# EAGLE design led_demo (EAGLE 7.1.0)
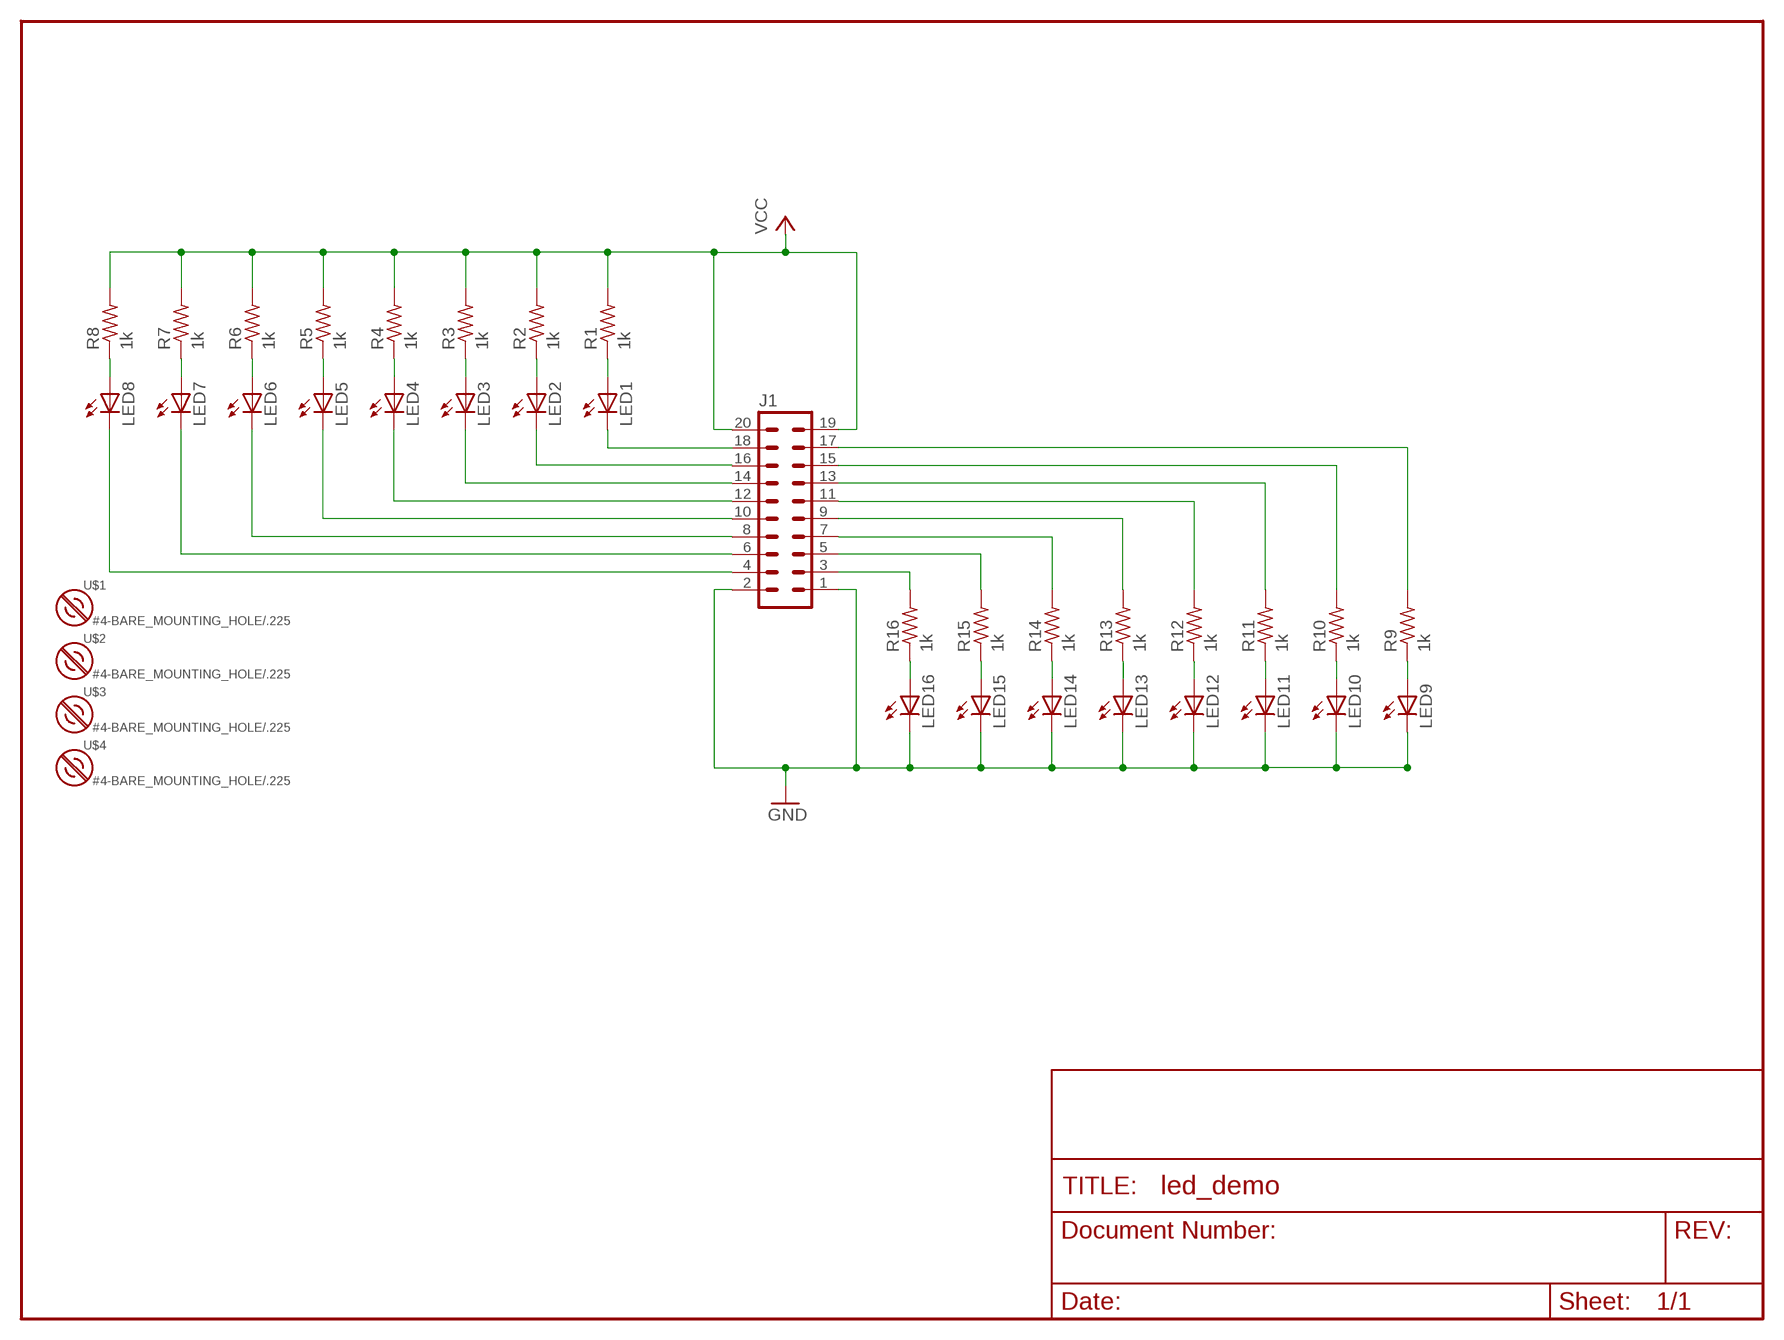
[diagram p0: schematic, sheet 1]

## Parts
J1  MA10-2  [MA10-2]
LED1  LED3MM  [LED3MM]
LED2  LED3MM  [LED3MM]
LED3  LED3MM  [LED3MM]
LED4  LED3MM  [LED3MM]
LED5  LED3MM  [LED3MM]
LED6  LED3MM  [LED3MM]
LED7  LED3MM  [LED3MM]
LED8  LED3MM  [LED3MM]
LED9  LED3MM  [LED3MM]
LED10  LED3MM  [LED3MM]
LED11  LED3MM  [LED3MM]
LED12  LED3MM  [LED3MM]
LED13  LED3MM  [LED3MM]
LED14  LED3MM  [LED3MM]
LED15  LED3MM  [LED3MM]
LED16  LED3MM  [LED3MM]
R1  1k  R-US_0204/2V  [0204V]
R2  1k  R-US_0204/2V  [0204V]
R3  1k  R-US_0204/2V  [0204V]
R4  1k  R-US_0204/2V  [0204V]
R5  1k  R-US_0204/2V  [0204V]
R6  1k  R-US_0204/2V  [0204V]
R7  1k  R-US_0204/2V  [0204V]
R8  1k  R-US_0204/2V  [0204V]
R9  1k  R-US_0204/2V  [0204V]
R10  1k  R-US_0204/2V  [0204V]
R11  1k  R-US_0204/2V  [0204V]
R12  1k  R-US_0204/2V  [0204V]
R13  1k  R-US_0204/2V  [0204V]
R14  1k  R-US_0204/2V  [0204V]
R15  1k  R-US_0204/2V  [0204V]
R16  1k  R-US_0204/2V  [0204V]
U$1  #4-BARE_MOUNTING_HOLE/.225  [#4/.225-BARE+HEAD_OR_SMALL_NUT]
U$2  #4-BARE_MOUNTING_HOLE/.225  [#4/.225-BARE+HEAD_OR_SMALL_NUT]
U$3  #4-BARE_MOUNTING_HOLE/.225  [#4/.225-BARE+HEAD_OR_SMALL_NUT]
U$4  #4-BARE_MOUNTING_HOLE/.225  [#4/.225-BARE+HEAD_OR_SMALL_NUT]

## Nets
GND: J1.1 J1.2 LED9.K(C) LED10.K(C) LED11.K(C) LED12.K(C) LED13.K(C) LED14.K(C) LED15.K(C) LED16.K(C)
N3: J1.3 R16.2
N4: J1.4 LED8.K(C)
N5: J1.5 R15.2
N6: J1.6 LED7.K(C)
N7: J1.7 R14.2
N8: J1.8 LED6.K(C)
N9: J1.9 R13.2
N10: J1.10 LED5.K(C)
N11: J1.11 R12.2
N12: J1.12 LED4.K(C)
N13: J1.13 R11.2
N14: J1.14 LED3.K(C)
N15: J1.15 R10.2
N16: J1.16 LED2.K(C)
N17: J1.17 R9.2
N18: J1.18 LED1.K(C)
N$1: LED1.A R1.1
N$2: LED2.A R2.1
N$3: LED3.A R3.1
N$4: LED4.A R4.1
N$5: LED5.A R5.1
N$6: LED6.A R6.1
N$7: LED7.A R7.1
N$8: LED8.A R8.1
N$17: LED9.A R9.1
N$18: LED10.A R10.1
N$19: LED11.A R11.1
N$20: LED12.A R12.1
N$21: LED13.A R13.1
N$22: LED14.A R14.1
N$23: LED15.A R15.1
N$24: LED16.A R16.1
VCC: J1.19 J1.20 R1.2 R2.2 R3.2 R4.2 R5.2 R6.2 R7.2 R8.2

## Library data of the parts
J1 = MA_HEADER:MA10-2: PIN HEADER; OC_FARNELL: unknown; OC_NEWARK: unknown
LED1-LED16 = adafruit:LED: LED OSRAM: - CHIPLED LG R971, LG N971, LY N971, LG Q971, LY Q971, LO R971, LY R971 LH N974, LH R974 LS Q976, LO Q976, LY Q976 LO Q996 - Hyper CHIPLED LW Q18S LB Q993, LB Q99A, LB R99A - SideLED LS A670, LO A670, LY A670, LG A670, LP A670 LB A673, LV A673, LT A673, LW A673 LH A674 LY A675 LS A676, LA A676, LO A676, LY A676, LW A676 LS A679, LY A679, LG A679 - Hyper Micro SIDELED® LS Y876, LA Y876, LO Y876, LY Y876 LT Y87S - SmartLED LW L88C, LW L88S LB L89C, LB L89S, LG L890 LS L89K, LO L89K, LY L89K LS L896, LA L896, LO L896, LY L896 - TOPLED LS T670, LO T670, LY T670, LG T670, LP T670 LSG T670, LSP T670, LSY T670, LOP T670, LYG T670 LG T671, LOG T671, LSG T671 LB T673, LV T673, LT T673, LW T673 LH T674 LS T676, LA T676, LO T676, LY T676, LB T676, LH T676, LSB T676, LW T676 LB T67C, LV T67C, LT T67C, LS T67K, LO T67K, LY T67K, LW E67C LS E67B, LA E67B, LO E67B, LY E67B, LB E67C, LV E67C, LT E67C LW T67C LS T679, LY T679, LG T679 LS T770, LO T770, LY T770, LG T770, LP T770 LB T773, LV T773, LT T773, LW T773 LH T774 LS E675, LA E675, LY E675, LS T675 LS T776, LA T776, LO T776, LY T776, LB T776 LHGB T686 LT T68C, LB T68C - Hyper Mini TOPLED® LB M676 - Mini TOPLED Santana® LG M470 LS M47K, LO M47K, LY M47K Source: http://www.osram.convergy.de/
R1-R16 = adafruit:R-US_: RESISTOR, American symbol
U$1-U$4 = mount:#4-BARE_MOUNTING_HOLE: 1/8" drill hole for #4 screw mount

## Board
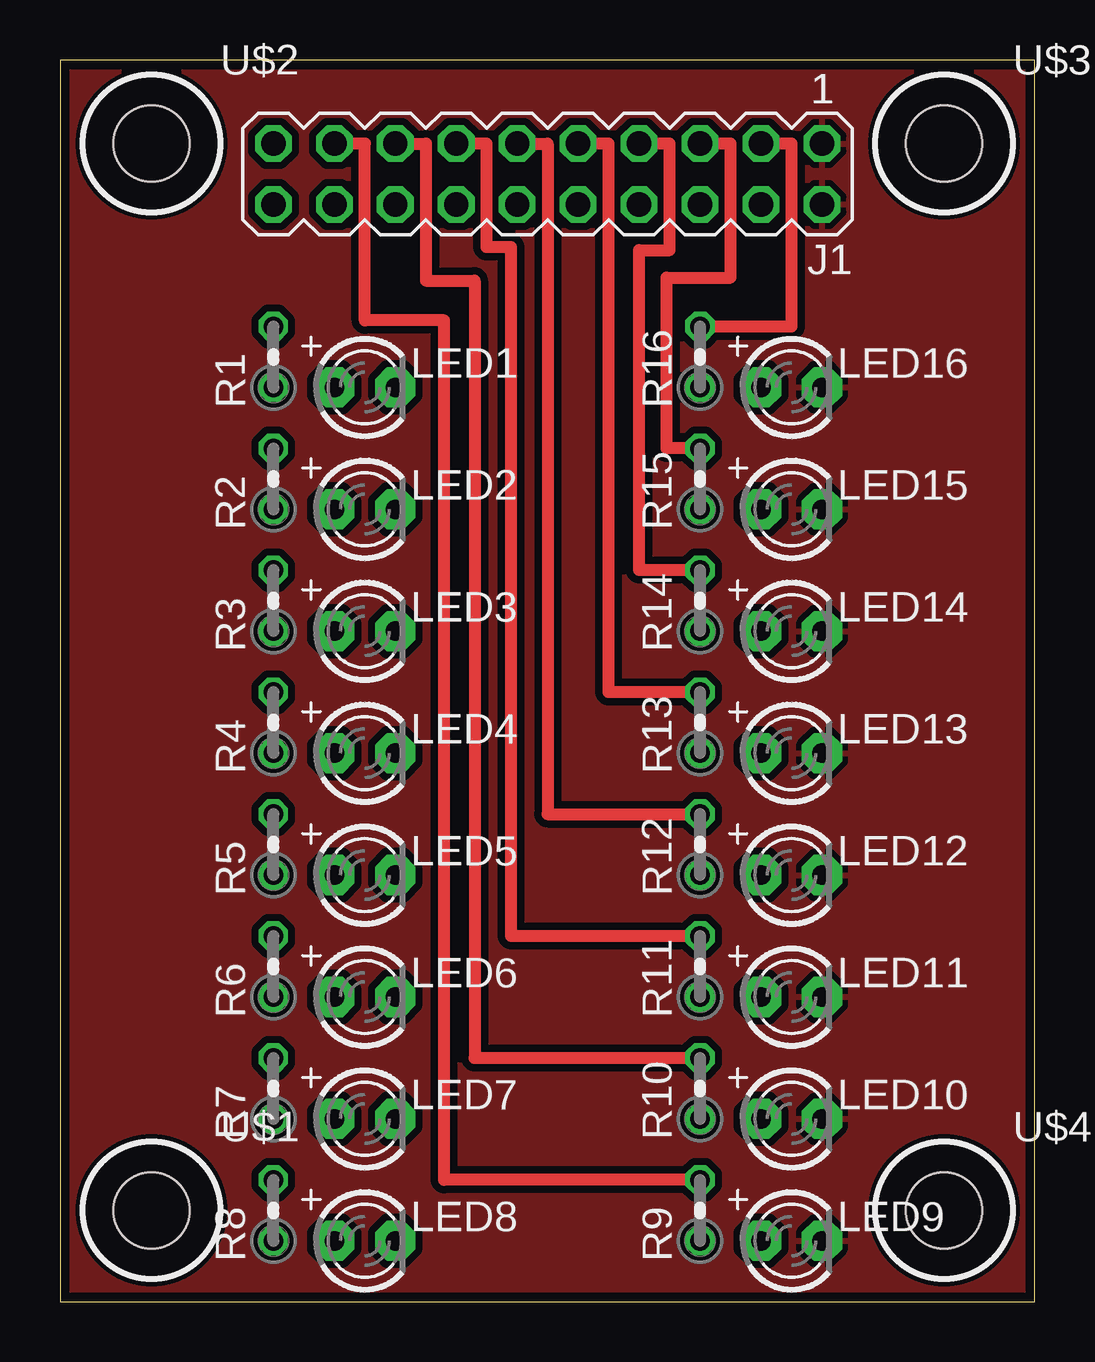
[diagram p1: board, top side]
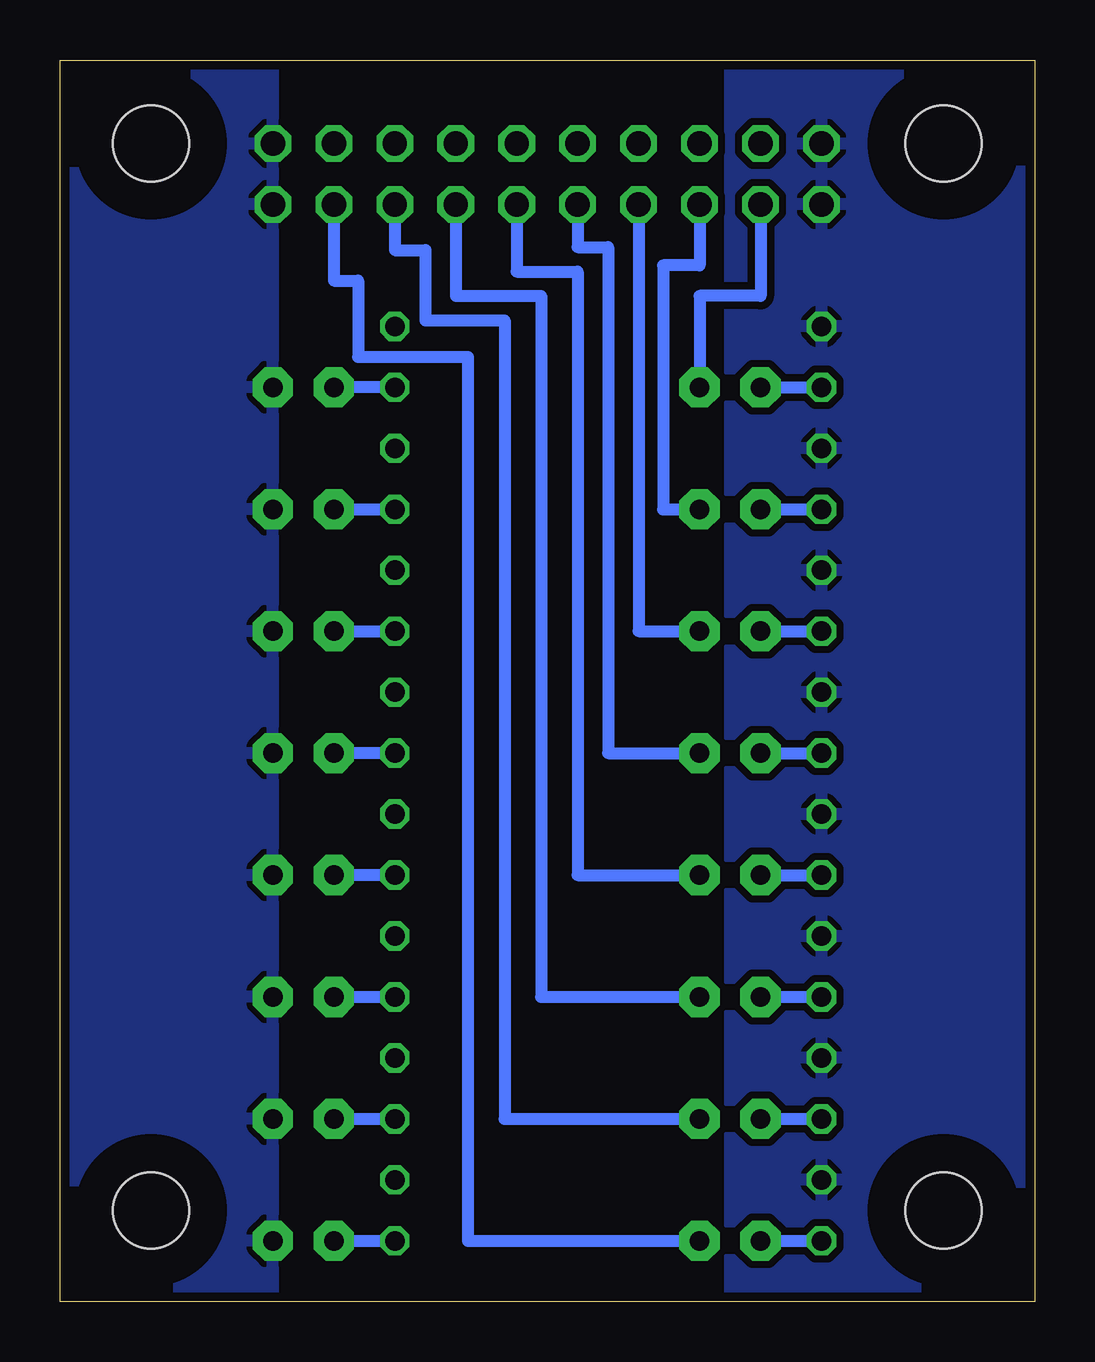
[diagram p2: board, bottom side, seen from below]

Size 40.62 x 51.74 mm. Coordinates in mm from the lower left corner, seen from the top.
Outline: 0,0 40.62,0 40.62,51.74 0,51.74 0,0
Copper layers (1*16): Top 0.0178mm / dielectric 59mil / Bottom 0.0178mm
Design rules "epl-lpkf": minimum track width 8mil, minimum drill 0.35mm, track to track 8mil, track to pad 8mil, pad to pad 8mil, via to via 8mil, smd to smd 8mil, copper to edge 15mil, drill to drill 15mil, minimum pad ring 8mil, minimum via ring 8mil, stop-mask expansion 3mil, vias tented up to drill 0mil, thermal gap 10mil

### Footprints (pad centres in the part's own frame; a part is rotated, then mirrored left to right if it is on the bottom)
MA10-2 = drill 1.016 octagon: 1 -11.43,-1.27; 2 -11.43,1.27; 3 -8.89,-1.27; 4 -8.89,1.27; 5 -6.35,-1.27; 6 -6.35,1.27; 7 -3.81,-1.27; 8 -3.81,1.27; 9 -1.27,-1.27; 10 -1.27,1.27; 11 1.27,-1.27; 12 1.27,1.27; 13 3.81,-1.27; 14 3.81,1.27; 15 6.35,-1.27; 16 6.35,1.27; 17 8.89,-1.27; 18 8.89,1.27; 19 11.43,-1.27; 20 11.43,1.27
LED3MM = drill 0.813 pad 1.676 octagon: A -1.27,0; K 1.27,0
0204V = drill 0.813 octagon: 1 -1.27,0; 2 1.27,0
#4/.225-BARE+HEAD_OR_SMALL_NUT = hole 3.175: 0,0

### Placement (x,y rotation side)
J1  20.32,46.99 180 top
LED1  12.7,38.1 0 top
LED2  12.7,33.02 0 top
LED3  12.7,27.94 0 top
LED4  12.7,22.86 0 top
LED5  12.7,17.78 0 top
LED6  12.7,12.7 0 top
LED7  12.7,7.62 0 top
LED8  12.7,2.54 0 top
LED9  30.48,2.54 0 top
LED10  30.48,7.62 0 top
LED11  30.48,12.7 0 top
LED12  30.48,17.78 0 top
LED13  30.48,22.86 0 top
LED14  30.48,27.94 0 top
LED15  30.48,33.02 0 top
LED16  30.48,38.1 0 top
R1  8.89,39.37 90 top
R2  8.89,34.29 90 top
R3  8.89,29.21 90 top
R4  8.89,24.13 90 top
R5  8.89,19.05 90 top
R6  8.89,13.97 90 top
R7  8.89,8.89 90 top
R8  8.89,3.81 90 top
R9  26.67,3.81 90 top
R10  26.67,8.89 90 top
R11  26.67,13.97 90 top
R12  26.67,19.05 90 top
R13  26.67,24.13 90 top
R14  26.67,29.21 90 top
R15  26.67,34.29 90 top
R16  26.67,39.37 90 top
U$1  3.81,3.81 0 top
U$2  3.81,48.26 0 top
U$3  36.83,48.26 0 top
U$4  36.83,3.81 0 top

### Tracks (layer width: path | path; a pad name or v marks a point on that pad's centre or on a via)
GND
  pour Bottom (isolate 0.305): 31.75,52.07 31.75,0 41.91,0 41.91,52.07
  pour Top (isolate 0.305): 0,51.44 40.64,51.44 40.64,0 0,0
N3
  Top 0.508: R16.2 30.48,40.64 30.48,48.26 J1.3
N4
  Bottom 0.508: J1.4 29.21,42.55 28.19,42.55 28.19,39.37 23.62,39.37 23.62,2.54 LED8.K
N5
  Top 0.508: R15.2 25.27,35.56 25.27,42.67 27.94,42.67 27.94,48.26 J1.5
N6
  Bottom 0.508: J1.6 26.67,43.81 25.4,43.81 25.4,40.89 22.1,40.89 22.1,7.62 LED7.K
N7
  Top 0.508: R14.2 24.13,30.48 24.13,43.81 25.4,43.81 25.4,48.26 J1.7
N8
  Bottom 0.508: J1.8 24.13,41.91 20.57,41.91 20.57,12.7 LED6.K
N9
  Top 0.508: R13.2 22.86,25.4 22.86,48.26 J1.9
N10
  Bottom 0.508: J1.10 21.59,42.93 19.05,42.93 19.05,17.78 LED5.K
N11
  Top 0.508: J1.11 20.32,48.26 20.32,20.32 R12.2
N12
  Bottom 0.508: J1.12 19.05,43.94 17.78,43.94 17.78,22.86 LED4.K
N13
  Top 0.508: R11.2 18.8,15.24 18.8,43.94 17.78,43.94 17.78,48.26 J1.13
N14
  Bottom 0.508: J1.14 16.51,27.94 LED3.K
N15
  Top 0.508: J1.15 15.24,48.26 15.24,42.55 17.27,42.55 17.27,10.16 R10.2
N16
  Bottom 0.508: J1.16 13.97,43.18 15.49,43.18 15.49,33.02 LED2.K
N17
  Top 0.508: R9.2 16,5.08 16,40.89 12.7,40.89 12.7,48.26 J1.17
N18
  Bottom 0.508: J1.18 11.43,41.91 13.97,41.91 LED1.K
N$1
  Bottom 0.508: LED1.A R1.1
N$2
  Bottom 0.508: LED2.A R2.1
N$3
  Bottom 0.508: LED3.A R3.1
N$4
  Bottom 0.508: LED4.A R4.1
N$5
  Bottom 0.508: LED5.A R5.1
N$6
  Bottom 0.508: LED6.A R6.1
N$7
  Bottom 0.508: LED7.A R7.1
N$8
  Bottom 0.508: LED8.A R8.1
N$17
  Bottom 0.508: LED9.A R9.1
N$18
  Bottom 0.508: LED10.A R10.1
N$19
  Bottom 0.508: LED11.A R11.1
N$20
  Bottom 0.508: R12.1 LED12.A
N$21
  Bottom 0.508: R13.1 LED13.A
N$22
  Bottom 0.508: LED14.A R14.1
N$23
  Bottom 0.508: LED15.A R15.1
N$24
  Bottom 0.508: R16.1 LED16.A
VCC
  pour Bottom (isolate 0.305): 12.7,52.07 0,52.07 0,0 12.7,0